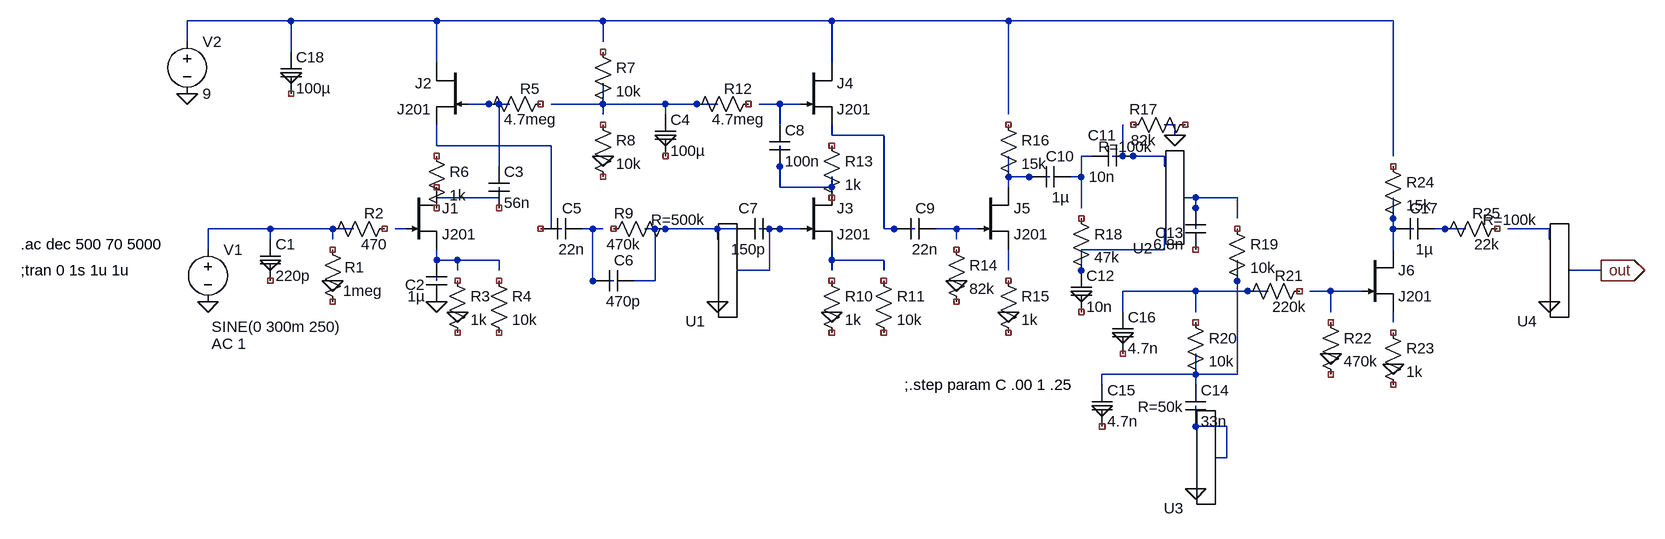
[diagram p0: schematic Wampler Pinnacle.asc]
Wampler Pinnacle.asc, the LTspice schematic file:
Version 4
SHEET 1 2384 680
WIRE 272 -192 112 -192
WIRE 496 -192 272 -192
WIRE 752 -192 496 -192
WIRE 1104 -192 752 -192
WIRE 1376 -192 1104 -192
WIRE 1968 -192 1376 -192
WIRE 112 -160 112 -192
WIRE 752 -160 752 -192
WIRE 272 -144 272 -192
WIRE 496 -128 496 -192
WIRE 1104 -128 1104 -192
WIRE 592 -64 544 -64
WIRE 608 -64 592 -64
WIRE 752 -64 752 -96
WIRE 752 -64 672 -64
WIRE 848 -64 752 -64
WIRE 928 -64 848 -64
WIRE 1024 -64 992 -64
WIRE 1056 -64 1024 -64
WIRE 752 -48 752 -64
WIRE 848 -48 848 -64
WIRE 1376 -48 1376 -192
WIRE 1024 -32 1024 -64
WIRE 1632 -32 1616 -32
WIRE 1104 -16 1104 -32
WIRE 1184 -16 1104 -16
WIRE 1632 -16 1632 -32
WIRE 496 0 496 -32
WIRE 672 0 496 0
WIRE 1504 16 1488 16
WIRE 1552 16 1552 -32
WIRE 1552 16 1536 16
WIRE 1616 16 1552 16
WIRE 1968 16 1968 -192
WIRE 592 32 592 -64
WIRE 1616 32 1616 16
WIRE 1376 48 1376 16
WIRE 1440 48 1376 48
WIRE 1488 48 1488 16
WIRE 1488 48 1472 48
WIRE 1024 64 1024 0
WIRE 1104 64 1104 48
WIRE 1104 64 1024 64
WIRE 1376 64 1376 48
WIRE 592 80 592 64
WIRE 592 80 496 80
WIRE 1664 80 1648 80
WIRE 1728 80 1664 80
WIRE 1488 96 1488 48
WIRE 1728 112 1728 80
WIRE 240 128 144 128
WIRE 336 128 240 128
WIRE 368 128 336 128
WIRE 448 128 432 128
WIRE 672 128 672 0
WIRE 688 128 672 128
WIRE 736 128 720 128
WIRE 752 128 736 128
WIRE 832 128 816 128
WIRE 928 128 832 128
WIRE 960 128 928 128
WIRE 1008 128 992 128
WIRE 1056 128 1008 128
WIRE 1184 128 1184 -16
WIRE 1232 128 1184 128
WIRE 1296 128 1264 128
WIRE 1328 128 1296 128
WIRE 1664 128 1664 80
WIRE 1968 128 1968 80
WIRE 2000 128 1968 128
WIRE 2080 128 2032 128
WIRE 2208 128 2144 128
WIRE 240 144 240 128
WIRE 336 144 336 128
WIRE 928 144 928 128
WIRE 1296 144 1296 128
WIRE 2208 144 2208 128
WIRE 144 160 144 128
WIRE 1616 160 1616 128
WIRE 1616 160 1488 160
WIRE 1968 160 1968 128
WIRE 496 176 496 160
WIRE 528 176 496 176
WIRE 592 176 528 176
WIRE 1104 176 1104 160
WIRE 1184 176 1104 176
WIRE 528 192 528 176
WIRE 592 192 592 176
WIRE 1008 192 1008 128
WIRE 1008 192 960 192
WIRE 1104 192 1104 176
WIRE 1184 192 1184 176
WIRE 1376 192 1376 160
WIRE 1488 192 1488 160
WIRE 2288 192 2240 192
WIRE 496 208 496 176
WIRE 736 208 736 128
WIRE 768 208 736 208
WIRE 832 208 832 128
WIRE 832 208 800 208
WIRE 1664 224 1552 224
WIRE 1776 224 1664 224
WIRE 1872 224 1840 224
WIRE 1920 224 1872 224
WIRE 1552 256 1552 224
WIRE 1664 256 1664 224
WIRE 1872 256 1872 224
WIRE 1968 272 1968 256
WIRE 1664 352 1664 320
WIRE 1664 352 1520 352
WIRE 1728 352 1728 176
WIRE 1728 352 1664 352
WIRE 1520 368 1520 352
WIRE 1664 368 1664 352
WIRE 1664 432 1664 400
WIRE 1712 432 1664 432
WIRE 1712 480 1712 432
WIRE 1712 480 1696 480
FLAG 144 240 0
FLAG 336 208 0
FLAG 112 -80 0
FLAG 240 176 0
FLAG 496 240 0
FLAG 752 16 0
FLAG 848 -16 0
FLAG 1296 208 0
FLAG 1376 256 0
FLAG 1632 -16 0
FLAG 1488 224 0
FLAG 1664 528 0
FLAG 1520 400 0
FLAG 1552 288 0
FLAG 1872 320 0
FLAG 1968 336 0
FLAG 2208 240 0
FLAG 2288 192 out
IOPIN 2288 192 Out
FLAG 272 -112 0
FLAG 928 240 0
FLAG 1104 256 0
FLAG 528 256 0
SYMBOL voltage 144 144 R0
WINDOW 3 6 135 Left 0
WINDOW 123 6 161 Left 0
WINDOW 39 0 0 Left 0
SYMATTR Value SINE(0 300m 250)
SYMATTR Value2 AC 1
SYMATTR InstName V1
SYMBOL voltage 112 -176 R0
WINDOW 123 0 0 Left 0
WINDOW 39 0 0 Left 0
SYMATTR InstName V2
SYMATTR Value 9
SYMBOL res 320 144 R0
WINDOW 0 34 43 Left 0
WINDOW 3 32 79 Left 0
SYMATTR InstName R1
SYMATTR Value 1meg
SYMBOL res 432 112 R90
WINDOW 0 8 32 VBottom 0
WINDOW 3 24 32 VTop 0
SYMATTR InstName R2
SYMATTR Value 470
SYMBOL njf 448 64 R0
SYMATTR InstName J1
SYMATTR Value J201
SYMBOL njf 544 -128 M0
SYMATTR InstName J2
SYMATTR Value J201
SYMBOL res 480 0 R0
SYMATTR InstName R6
SYMATTR Value 1k
SYMBOL cap 224 144 R0
SYMATTR InstName C1
SYMATTR Value 220p
SYMBOL cap 512 240 R180
WINDOW 0 34 26 Left 0
WINDOW 3 34 8 Left 0
SYMATTR InstName C2
SYMATTR Value 1µ
SYMBOL res 512 192 R0
SYMATTR InstName R3
SYMATTR Value 1k
SYMBOL res 576 192 R0
SYMATTR InstName R4
SYMATTR Value 10k
SYMBOL res 672 -80 R90
WINDOW 0 8 32 VBottom 0
WINDOW 3 24 32 VTop 0
SYMATTR InstName R5
SYMATTR Value 4.7meg
SYMBOL cap 576 32 R0
SYMATTR InstName C3
SYMATTR Value 56n
SYMBOL res 736 -160 R0
SYMATTR InstName R7
SYMATTR Value 10k
SYMBOL res 736 -48 R0
SYMATTR InstName R8
SYMATTR Value 10k
SYMBOL cap 832 -48 R0
SYMATTR InstName C4
SYMATTR Value 100µ
SYMBOL cap 720 112 R90
WINDOW 0 0 16 VBottom 0
WINDOW 3 32 16 VTop 0
SYMATTR InstName C5
SYMATTR Value 22n
SYMBOL res 752 144 R270
WINDOW 0 24 32 VTop 0
WINDOW 3 8 32 VBottom 0
SYMATTR InstName R9
SYMATTR Value 470k
SYMBOL cap 800 192 R90
WINDOW 0 0 16 VBottom 0
WINDOW 3 32 16 VTop 0
SYMATTR InstName C6
SYMATTR Value 470p
SYMBOL EXTRA\\Misc\\pot 928 192 R180
SYMATTR InstName U1
SYMATTR Value R=500k
SYMBOL cap 960 144 R270
WINDOW 0 32 16 VTop 0
WINDOW 3 0 16 VBottom 0
SYMATTR InstName C7
SYMATTR Value 150p
SYMBOL njf 1056 64 R0
SYMATTR InstName J3
SYMATTR Value J201
SYMBOL njf 1056 -128 R0
SYMATTR InstName J4
SYMATTR Value J201
SYMBOL res 1088 192 R0
SYMATTR InstName R10
SYMATTR Value 1k
SYMBOL res 1168 192 R0
SYMATTR InstName R11
SYMATTR Value 10k
SYMBOL res 992 -80 R90
WINDOW 0 8 32 VBottom 0
WINDOW 3 24 32 VTop 0
SYMATTR InstName R12
SYMATTR Value 4.7meg
SYMBOL res 1088 -16 R0
SYMATTR InstName R13
SYMATTR Value 1k
SYMBOL cap 1008 -32 R0
SYMATTR InstName C8
SYMATTR Value 100n
SYMBOL cap 1264 112 R90
WINDOW 0 0 16 VBottom 0
WINDOW 3 32 16 VTop 0
SYMATTR InstName C9
SYMATTR Value 22n
SYMBOL res 1280 144 R0
SYMATTR InstName R14
SYMATTR Value 82k
SYMBOL njf 1328 64 R0
SYMATTR InstName J5
SYMATTR Value J201
SYMBOL res 1360 192 R0
SYMATTR InstName R15
SYMATTR Value 1k
SYMBOL res 1360 -48 R0
SYMATTR InstName R16
SYMATTR Value 15k
SYMBOL cap 1472 32 R90
WINDOW 0 0 16 VBottom 0
WINDOW 3 32 16 VTop 0
SYMATTR InstName C10
SYMATTR Value 1µ
SYMBOL cap 1504 32 R270
WINDOW 0 32 16 VTop 0
WINDOW 3 0 16 VBottom 0
SYMATTR InstName C11
SYMATTR Value 10n
SYMBOL res 1552 -16 R270
WINDOW 0 24 32 VTop 0
WINDOW 3 8 32 VBottom 0
SYMATTR InstName R17
SYMATTR Value 82k
SYMBOL EXTRA\\Misc\\pot 1616 80 R180
SYMATTR InstName U2
SYMATTR Value R=100k
SYMBOL res 1472 96 R0
SYMATTR InstName R18
SYMATTR Value 47k
SYMBOL cap 1472 192 R0
SYMATTR InstName C12
SYMATTR Value 10n
SYMBOL res 1712 112 R0
SYMATTR InstName R19
SYMATTR Value 10k
SYMBOL cap 1680 160 R180
WINDOW 0 34 26 Left 0
WINDOW 3 34 8 Left 0
SYMATTR InstName C13
SYMATTR Value 6.8n
SYMBOL res 1648 256 R0
SYMATTR InstName R20
SYMATTR Value 10k
SYMBOL cap 1648 368 R0
SYMATTR InstName C14
SYMATTR Value 33n
SYMBOL EXTRA\\Misc\\pot 1664 480 R180
SYMATTR InstName U3
SYMATTR Value R=50k
SYMATTR Value2 T=0.5
SYMBOL cap 1504 368 R0
SYMATTR InstName C15
SYMATTR Value 4.7n
SYMBOL res 1840 208 R90
WINDOW 0 8 32 VBottom 0
WINDOW 3 24 32 VTop 0
SYMATTR InstName R21
SYMATTR Value 220k
SYMBOL cap 1536 256 R0
SYMATTR InstName C16
SYMATTR Value 4.7n
SYMBOL res 1856 256 R0
SYMATTR InstName R22
SYMATTR Value 470k
SYMBOL njf 1920 160 R0
SYMATTR InstName J6
SYMATTR Value J201
SYMBOL res 1952 272 R0
SYMATTR InstName R23
SYMATTR Value 1k
SYMBOL res 1952 16 R0
SYMATTR InstName R24
SYMATTR Value 15k
SYMBOL cap 2032 112 R90
WINDOW 0 0 16 VBottom 0
WINDOW 3 32 16 VTop 0
SYMATTR InstName C17
SYMATTR Value 1µ
SYMBOL res 2144 112 R90
WINDOW 0 8 32 VBottom 0
WINDOW 3 24 32 VTop 0
SYMATTR InstName R25
SYMATTR Value 22k
SYMBOL EXTRA\\Misc\\pot 2208 192 R180
SYMATTR InstName U4
SYMATTR Value R=100k
SYMBOL cap 256 -144 R0
SYMATTR InstName C18
SYMATTR Value 100µ
TEXT -144 152 Left 0 !.ac dec 500 70 5000
TEXT -144 192 Left 0 !;tran 0 1s 1u 1u
TEXT 1216 368 Left 0 !;.step param C .00 1 .25

The netlist it stands for:
* Wampler Pinnacle.asc
V1 N013 0 SINE(0 300m 250) AC 1
V2 N001 0 9
R1 NC_01 NC_02 1meg
R2 NC_03 N013 470
* J1: J201 (symbol njf not certain, pin order unknown); nets seen at it: N014, N023
J2 N001 N002 N006 J201
R6 NC_05 NC_06 1k
C1 N013 NC_07 220p
C2 0 N023 1µ
R3 NC_08 NC_09 1k
R4 NC_10 NC_11 10k
R5 NC_12 N002 4.7meg
C3 N002 NC_13 56n
R7 NC_14 N003 10k
R8 NC_15 NC_16 10k
C4 N003 NC_17 100µ
C5 N015 NC_18 22n
R9 NC_19 N016 470k
C6 N016 N015 470p
XU1 0 N016 N017 R=500k
C7 N016 N017 150p
J3 N010 N017 N024 J201
J4 N001 N004 N005 J201
R10 NC_20 NC_21 1k
R11 NC_22 NC_23 10k
R12 NC_24 N003 4.7meg
R13 NC_25 NC_26 1k
C8 N004 N010 100n
C9 N018 N005 22n
R14 NC_27 NC_28 82k
J5 N009 N018 N025 J201
R15 NC_29 NC_30 1k
R16 NC_31 N009 15k
C10 N007 N009 1µ
C11 N007 N008 10n
R17 NC_32 NC_33 82k
XU2 N022 N008 N012 R=100k
R18 NC_34 N022 47k
C12 N022 NC_35 10n
R19 NC_36 N029 10k
C13 NC_37 N012 6.8n
R20 NC_38 N029 10k
C14 N029 N030 33n
XU3 0 N030 N030 R=50k T=0.5
C15 N029 NC_39 4.7n
R21 NC_40 N026 220k
C16 N026 NC_41 4.7n
R22 NC_42 NC_43 470k
J6 N019 N027 N028 J201
R23 NC_44 NC_45 1k
R24 NC_46 N019 15k
C17 N020 N019 1µ
R25 NC_47 N020 22k
XU4 0 N021 out R=100k
C18 N001 NC_48 100µ
.model NJF NJF
.model PJF PJF
.lib standard.jft
.ac dec 500 70 5000
;tran 0 1s 1u 1u
;.step param C .00 1 .25
.lib POT.lib
.backanno
.end